# Altium schematic sheet Sheet5.SchDoc
size A; SheetNumber: 5; SheetTotal: 6
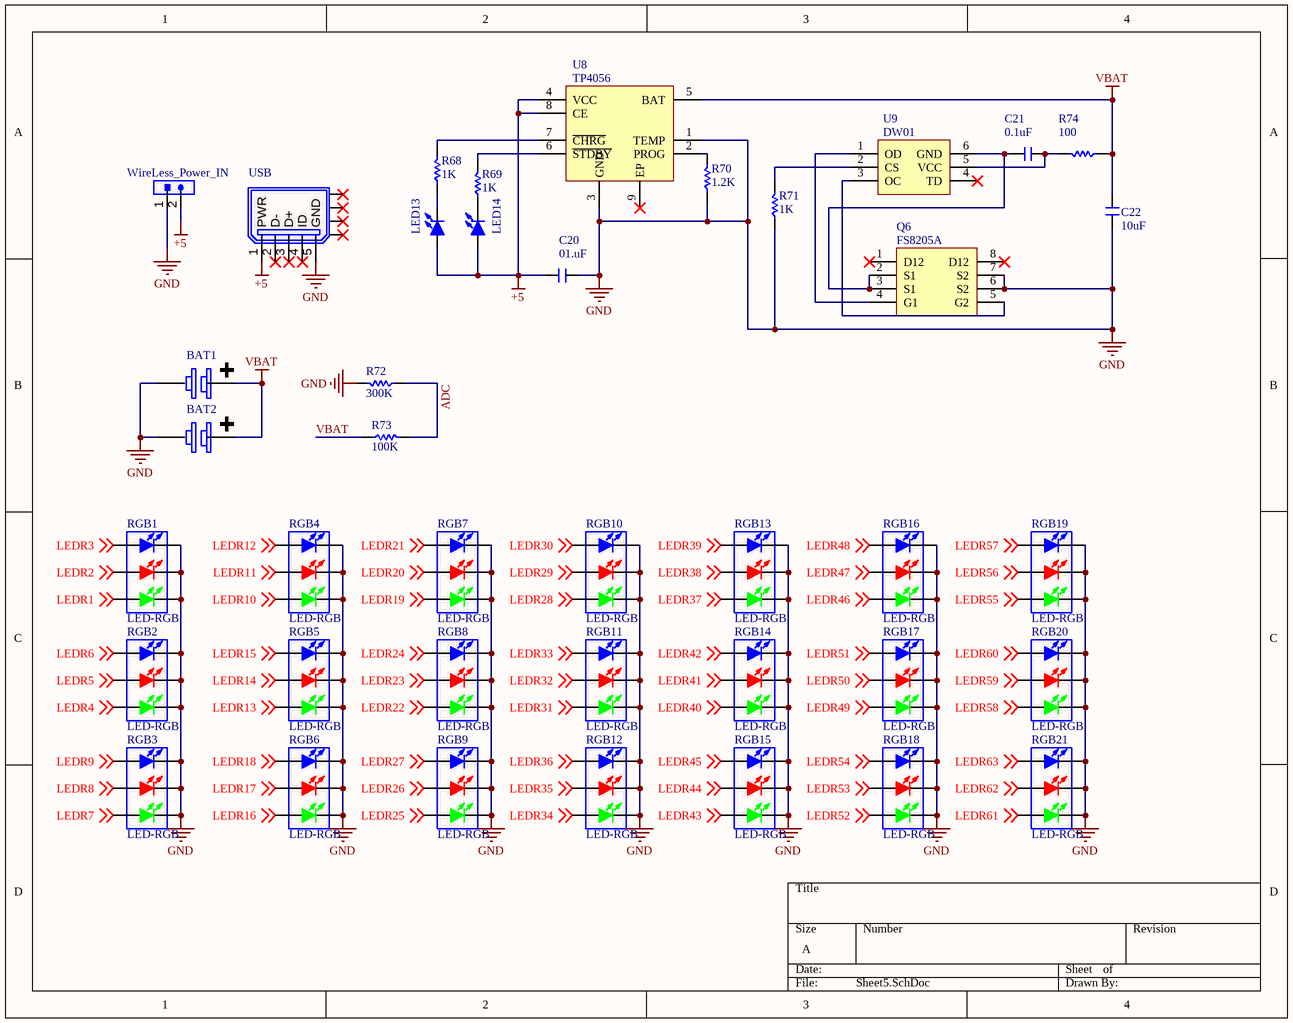
[diagram p0: Sheet5.SchDoc]

## Parts
BAT1  Battery 1850  [18650 SINGLE 2]  (value not drawn)
BAT2  Battery 1850  [18650 SINGLE 2]  (value not drawn)
C20  01.uF  [C 0402]
C21  0.1uF  [C 0402]
C22  10uF  [C 0603]
LED13  LED-SMD  [LED 0805R]  (value not drawn)
LED14  LED-SMD  [LED 0805G]  (value not drawn)
Q6  FS8205A  [SSOP8_L]
R68  1K  [R 0402]
R69  1K  [R 0402]
R70  1.2K  [R 0402]
R71  1K  [R 0402]
R72  300K  [R 0805]
R73  100K  [R 0805]
R74  100  [R 0402]
RGB1  LED-RGB  [LED 5050]
RGB2  LED-RGB  [LED 5050]
RGB3  LED-RGB  [LED 5050]
RGB4  LED-RGB  [LED 5050]
RGB5  LED-RGB  [LED 5050]
RGB6  LED-RGB  [LED 5050]
RGB7  LED-RGB  [LED 5050]
RGB8  LED-RGB  [LED 5050]
RGB9  LED-RGB  [LED 5050]
RGB10  LED-RGB  [LED 5050]
RGB11  LED-RGB  [LED 5050]
RGB12  LED-RGB  [LED 5050]
RGB13  LED-RGB  [LED 5050]
RGB14  LED-RGB  [LED 5050]
RGB15  LED-RGB  [LED 5050]
RGB16  LED-RGB  [LED 5050]
RGB17  LED-RGB  [LED 5050]
RGB18  LED-RGB  [LED 5050]
RGB19  LED-RGB  [LED 5050]
RGB20  LED-RGB  [LED 5050]
RGB21  LED-RGB  [LED 5050]
U8  TP4056  [SOP8_M-EP]
U9  DW01  [SOT23-6M]
USB  USB-5P  [USB-micro_B]  (value not drawn)
WireLess_Power_IN  HDR-1X2  [XH2.54-2P]  (value not drawn)

## Nets
+5: C20.2 LED13.1(A) LED14.1(A) U8.4(VCC) U8.8(CE) USB.1(PWR) WireLess_Power_IN.2
GND: BAT1.2(-) BAT2.2(-) C20.1 C22.1 Q6.6(S2) Q6.7(S2) R70.1 R71.1 R72.2 RGB1.2(BULE_K) RGB1.4(RED_K) RGB1.6(GREEN_K) RGB2.2(BULE_K) RGB2.4(RED_K) RGB2.6(GREEN_K) RGB3.2(BULE_K) RGB3.4(RED_K) RGB3.6(GREEN_K) RGB4.2(BULE_K) RGB4.4(RED_K) RGB4.6(GREEN_K) RGB5.2(BULE_K) RGB5.4(RED_K) RGB5.6(GREEN_K) RGB6.2(BULE_K) RGB6.4(RED_K) RGB6.6(GREEN_K) RGB7.2(BULE_K) RGB7.4(RED_K) RGB7.6(GREEN_K) RGB8.2(BULE_K) RGB8.4(RED_K) RGB8.6(GREEN_K) RGB9.2(BULE_K) RGB9.4(RED_K) RGB9.6(GREEN_K) RGB10.2(BULE_K) RGB10.4(RED_K) RGB10.6(GREEN_K) RGB11.2(BULE_K) RGB11.4(RED_K) RGB11.6(GREEN_K) RGB12.2(BULE_K) RGB12.4(RED_K) RGB12.6(GREEN_K) RGB13.2(BULE_K) RGB13.4(RED_K) RGB13.6(GREEN_K) RGB14.2(BULE_K) RGB14.4(RED_K) RGB14.6(GREEN_K) RGB15.2(BULE_K) RGB15.4(RED_K) RGB15.6(GREEN_K) RGB16.2(BULE_K) RGB16.4(RED_K) RGB16.6(GREEN_K) RGB17.2(BULE_K) RGB17.4(RED_K) RGB17.6(GREEN_K) RGB18.2(BULE_K) RGB18.4(RED_K) RGB18.6(GREEN_K) RGB19.2(BULE_K) RGB19.4(RED_K) RGB19.6(GREEN_K) RGB20.2(BULE_K) RGB20.4(RED_K) RGB20.6(GREEN_K) RGB21.2(BULE_K) RGB21.4(RED_K) RGB21.6(GREEN_K) U8.1(TEMP) U8.3(GND) USB.5(SHIELD) WireLess_Power_IN.1
VBAT: BAT1.1(+) BAT2.1(+) C22.2 R73.1 R74.1 U8.5(BAT)
ADC: R72.1 R73.2
LEDR1: RGB1.5(GREEN_A) ; off-sheet LEDR1
LEDR2: RGB1.3(RED_A) ; off-sheet LEDR2
LEDR3: RGB1.1(BULE_A) ; off-sheet LEDR3
LEDR4: RGB2.5(GREEN_A) ; off-sheet LEDR4
LEDR5: RGB2.3(RED_A) ; off-sheet LEDR5
LEDR6: RGB2.1(BULE_A) ; off-sheet LEDR6
LEDR7: RGB3.5(GREEN_A) ; off-sheet LEDR7
LEDR8: RGB3.3(RED_A) ; off-sheet LEDR8
LEDR9: RGB3.1(BULE_A) ; off-sheet LEDR9
LEDR10: RGB4.5(GREEN_A) ; off-sheet LEDR10
LEDR11: RGB4.3(RED_A) ; off-sheet LEDR11
LEDR12: RGB4.1(BULE_A) ; off-sheet LEDR12
LEDR13: RGB5.5(GREEN_A) ; off-sheet LEDR13
LEDR14: RGB5.3(RED_A) ; off-sheet LEDR14
LEDR15: RGB5.1(BULE_A) ; off-sheet LEDR15
LEDR16: RGB6.5(GREEN_A) ; off-sheet LEDR16
LEDR17: RGB6.3(RED_A) ; off-sheet LEDR17
LEDR18: RGB6.1(BULE_A) ; off-sheet LEDR18
LEDR19: RGB7.5(GREEN_A) ; off-sheet LEDR19
LEDR20: RGB7.3(RED_A) ; off-sheet LEDR20
LEDR21: RGB7.1(BULE_A) ; off-sheet LEDR21
LEDR22: RGB8.5(GREEN_A) ; off-sheet LEDR22
LEDR23: RGB8.3(RED_A) ; off-sheet LEDR23
LEDR24: RGB8.1(BULE_A) ; off-sheet LEDR24
LEDR25: RGB9.5(GREEN_A) ; off-sheet LEDR25
LEDR26: RGB9.3(RED_A) ; off-sheet LEDR26
LEDR27: RGB9.1(BULE_A) ; off-sheet LEDR27
LEDR28: RGB10.5(GREEN_A) ; off-sheet LEDR28
LEDR29: RGB10.3(RED_A) ; off-sheet LEDR29
LEDR30: RGB10.1(BULE_A) ; off-sheet LEDR30
LEDR31: RGB11.5(GREEN_A) ; off-sheet LEDR31
LEDR32: RGB11.3(RED_A) ; off-sheet LEDR32
LEDR33: RGB11.1(BULE_A) ; off-sheet LEDR33
LEDR34: RGB12.5(GREEN_A) ; off-sheet LEDR34
LEDR35: RGB12.3(RED_A) ; off-sheet LEDR35
LEDR36: RGB12.1(BULE_A) ; off-sheet LEDR36
LEDR37: RGB13.5(GREEN_A) ; off-sheet LEDR37
LEDR38: RGB13.3(RED_A) ; off-sheet LEDR38
LEDR39: RGB13.1(BULE_A) ; off-sheet LEDR39
LEDR40: RGB14.5(GREEN_A) ; off-sheet LEDR40
LEDR41: RGB14.3(RED_A) ; off-sheet LEDR41
LEDR42: RGB14.1(BULE_A) ; off-sheet LEDR42
LEDR43: RGB15.5(GREEN_A) ; off-sheet LEDR43
LEDR44: RGB15.3(RED_A) ; off-sheet LEDR44
LEDR45: RGB15.1(BULE_A) ; off-sheet LEDR45
LEDR46: RGB16.5(GREEN_A) ; off-sheet LEDR46
LEDR47: RGB16.3(RED_A) ; off-sheet LEDR47
LEDR48: RGB16.1(BULE_A) ; off-sheet LEDR48
LEDR49: RGB17.5(GREEN_A) ; off-sheet LEDR49
LEDR50: RGB17.3(RED_A) ; off-sheet LEDR50
LEDR51: RGB17.1(BULE_A) ; off-sheet LEDR51
LEDR52: RGB18.5(GREEN_A) ; off-sheet LEDR52
LEDR53: RGB18.3(RED_A) ; off-sheet LEDR53
LEDR54: RGB18.1(BULE_A) ; off-sheet LEDR54
LEDR55: RGB19.5(GREEN_A) ; off-sheet LEDR55
LEDR56: RGB19.3(RED_A) ; off-sheet LEDR56
LEDR57: RGB19.1(BULE_A) ; off-sheet LEDR57
LEDR58: RGB20.5(GREEN_A) ; off-sheet LEDR58
LEDR59: RGB20.3(RED_A) ; off-sheet LEDR59
LEDR60: RGB20.1(BULE_A) ; off-sheet LEDR60
LEDR61: RGB21.5(GREEN_A) ; off-sheet LEDR61
LEDR62: RGB21.3(RED_A) ; off-sheet LEDR62
LEDR63: RGB21.1(BULE_A) ; off-sheet LEDR63
NetC21_1: C21.1 Q6.2(S1) Q6.3(S1) U9.6(GND)
NetC21_2: C21.2 R74.2 U9.5(VCC)
NetLED13_2: LED13.2(K) R68.1
NetLED14_2: LED14.2(K) R69.1
NetQ6_4: Q6.4(G1) U9.1(OD)
NetQ6_5: Q6.5(G2) U9.3(OC)
NetR68_2: R68.2 U8.7(~{CHRG})
NetR69_2: R69.2 U8.6(~{STDBY})
NetR70_2: R70.2 U8.2(PROG)
NetR71_2: R71.2 U9.2(CS)

Not connected (* = marked no-connect by the designer): Q6 1(D12)* 8(D12)*; U8 9(EP)*; U9 4(TD)*; USB 2(D-)* 3(D+)* 4(ID)*

## Library data of the parts
C20-C22 = C: Non-polar patch capacitor; BOM名称: 无极性贴片电容; 版权归属: 源创客; 学习资源: www.ooocke.com
LED13 LED14 = LED-SMD: Patch LED; BOM名称: 贴片LED; 版权归属: 源创客; 学习资源: www.ooocke.com
Q6 = FS8205A: Dual N-Channel Enhancement Mode Power MOSFET
R68-R74 = R: Chip resistor; 版权归属: 源创客; BOM名称: Chip resistor; 学习资源: www.ooocke.com
RGB1-RGB21 = LED-RGB: Three primary color LED; BOM名称: 三基色LED; 版权归属: 源创客; 学习资源: www.ooocke.com
U8 = TP4056: Lithium battery charge management; BOM名称: 锂电池充电管理; 版权归属: 源创客; 学习资源: www.ooocke.com
U9 = DW01: Lithium battery overcurrent protection IC; BOM名称: 过流保护IC; 版权归属: 源创客; 学习资源: www.ooocke.com
USB = USB-5P: Micro & Mini USB female; BOM名称: 微型USB母座; 版权归属: 源创客; 学习资源: www.ooocke.com
WireLess_Power_IN = Header 2: 2P Connector; BOM名称: 2P接插件; 版权归属: 源创客; 学习资源: www.ooocke.com